# Altium schematic sheet USBC.SchDoc: DARKYDEN_USBC_A
size Letter; ApprovedBy: APPROUVÉ PAR; Author: Harold Malbrouck; Organization: Cegep Limoilou; Address1: 1300, 8e Avenue; Address2: Québec, QC; Address3: Canada; Address4: G1J 5L5; Revision: Rev.C; SheetNumber: 1; SheetTotal: 15
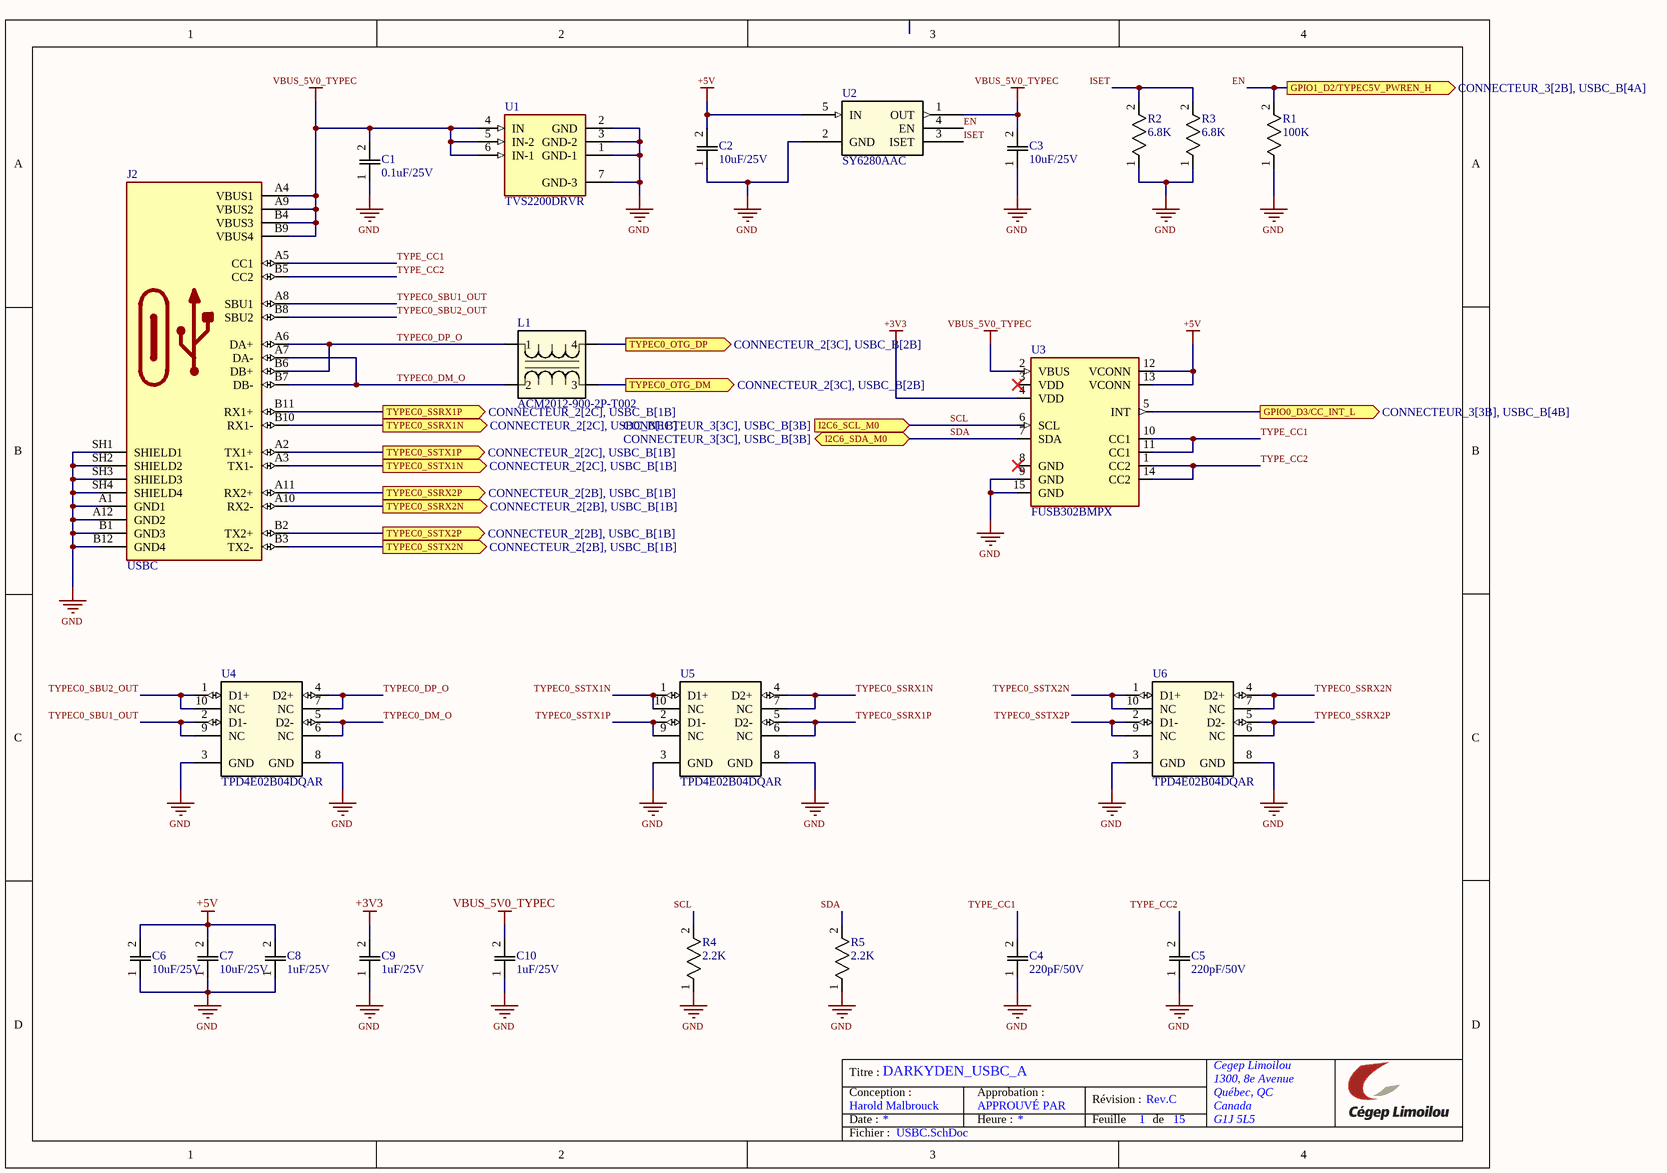
[diagram p0: USBC.SchDoc]

## Parts
C1  0.1uF/25V  [CAP_CC0805_YAG]
C2  10uF/25V  [CAP_CC0805_YAG]
C3  10uF/25V  [CAP_CC0805_YAG]
C4  220pF/50V  [CAP_CC0805_YAG]
C5  220pF/50V  [CAP_CC0805_YAG]
C6  10uF/25V  [CAP_CC0805_YAG]
C7  10uF/25V  [CAP_CC0805_YAG]
C8  1uF/25V  [CAP_CC0805_YAG]
C9  1uF/25V  [CAP_CC0805_YAG]
C10  1uF/25V  [CAP_CC0805_YAG]
J2  USBC  [MOLEX_2012670005]
L1  ACM2012-900-2P-T002  [ACM2012_TDK]
R1  100K  [RES_0816_SUS]
R2  6.8K  [RES_0816_SUS]
R3  6.8K  [RES_0816_SUS]
R4  2.2K  [RES_0816_SUS]
R5  2.2K  [RES_0816_SUS]
U1  TVS2200DRVR  [SON65P200X200X80-7N]
U2  SY6280AAC  [SOT23-5_SGY-M]
U3  FUSB302BMPX  [MLP-14]
U4  TPD4E02B04DQAR  [DQA0010A]
U5  TPD4E02B04DQAR  [DQA0010A]
U6  TPD4E02B04DQAR  [DQA0010A]

## Ports
GPIO0_D3/CC_INT_L (out, see CONNECTEUR_3[3B], USBC_B[4B]), GPIO1_D2/TYPEC5V_PWREN_H (out, see CONNECTEUR_3[2B], USBC_B[4A]), I2C6_SCL_M0 (in, see CONNECTEUR_3[3C], USBC_B[3B]), I2C6_SDA_M0 (bidir, see CONNECTEUR_3[3C], USBC_B[3B]), TYPEC0_OTG_DM (out, see CONNECTEUR_2[3C], USBC_B[2B]), TYPEC0_OTG_DP (out, see CONNECTEUR_2[3C], USBC_B[2B]), TYPEC0_SSRX1N (out, see CONNECTEUR_2[2C], USBC_B[1B]), TYPEC0_SSRX1P (out, see CONNECTEUR_2[2C], USBC_B[1B]), TYPEC0_SSRX2N (out, see CONNECTEUR_2[2B], USBC_B[1B]), TYPEC0_SSRX2P (out, see CONNECTEUR_2[2B], USBC_B[1B]), TYPEC0_SSTX1N (out, see CONNECTEUR_2[2C], USBC_B[1B]), TYPEC0_SSTX1P (out, see CONNECTEUR_2[2C], USBC_B[1B]), TYPEC0_SSTX2N (out, see CONNECTEUR_2[2B], USBC_B[1B]), TYPEC0_SSTX2P (out, see CONNECTEUR_2[2B], USBC_B[1B])

## Nets
+3V3: C9.2 U3.4(VDD)
+5V: C2.2 C6.2 C7.2 C8.2 U2.5(IN) U3.12(VCONN) U3.13(VCONN)
GND: C1.1 C2.1 C3.1 C4.1 C5.1 C6.1 C7.1 C8.1 C9.1 C10.1 J2.A1(GND1) J2.A12(GND2) J2.B1(GND3) J2.B12(GND4) J2.SH1(SHIELD1) J2.SH2(SHIELD2) J2.SH3(SHIELD3) J2.SH4(SHIELD4) R1.1 R2.1 R3.1 R4.1 R5.1 U1.1(GND-1) U1.2(GND) U1.3(GND-2) U1.7(GND-3) U2.2(GND) U3.9(GND) U3.15(GND) U4.3(GND) U4.8(GND) U5.3(GND) U5.8(GND) U6.3(GND) U6.8(GND)
VBUS_5V0_TYPEC: C1.2 C3.2 C10.2 J2.A4(VBUS1) J2.A9(VBUS2) J2.B4(VBUS3) J2.B9(VBUS4) U1.4(IN) U1.5(IN-2) U1.6(IN-1) U2.1(OUT) U3.2(VBUS)
EN: R1.2 U2.4(EN) ; port GPIO1_D2/TYPEC5V_PWREN_H
GPIO0_D3/CC_INT_L: U3.5(INT) ; port GPIO0_D3/CC_INT_L
ISET: R2.2 R3.2 U2.3(ISET)
SCL: R4.2 U3.6(SCL) ; port I2C6_SCL_M0
SDA: R5.2 U3.7(SDA) ; port I2C6_SDA_M0
TYPE_CC1: C4.2 J2.A5(CC1) U3.10(CC1) U3.11(CC1)
TYPE_CC2: C5.2 J2.B5(CC2) U3.1(CC2) U3.14(CC2)
TYPEC0_DM_O: J2.A7(DA-) J2.B7(DB-) L1.2 U4.5(D2-) U4.6(NC)
TYPEC0_DP_O: J2.A6(DA+) J2.B6(DB+) L1.1 U4.4(D2+) U4.7(NC)
TYPEC0_OTG_DM: L1.3 ; port TYPEC0_OTG_DM
TYPEC0_OTG_DP: L1.4 ; port TYPEC0_OTG_DP
TYPEC0_SBU1_OUT: J2.A8(SBU1) U4.2(D1-) U4.9(NC)
TYPEC0_SBU2_OUT: J2.B8(SBU2) U4.1(D1+) U4.10(NC)
TYPEC0_SSRX1N: J2.B10(RX1-) ; port TYPEC0_SSRX1N
TYPEC0_SSRX1N: U5.4(D2+) U5.7(NC)  [a separate net that carries the same name]
TYPEC0_SSRX1P: J2.B11(RX1+) ; port TYPEC0_SSRX1P
TYPEC0_SSRX1P: U5.5(D2-) U5.6(NC)  [a separate net that carries the same name]
TYPEC0_SSRX2N: J2.A10(RX2-) ; port TYPEC0_SSRX2N
TYPEC0_SSRX2N: U6.4(D2+) U6.7(NC)  [a separate net that carries the same name]
TYPEC0_SSRX2P: J2.A11(RX2+) ; port TYPEC0_SSRX2P
TYPEC0_SSRX2P: U6.5(D2-) U6.6(NC)  [a separate net that carries the same name]
TYPEC0_SSTX1N: J2.A3(TX1-) ; port TYPEC0_SSTX1N
TYPEC0_SSTX1N: U5.1(D1+) U5.10(NC)  [a separate net that carries the same name]
TYPEC0_SSTX1P: J2.A2(TX1+) ; port TYPEC0_SSTX1P
TYPEC0_SSTX1P: U5.2(D1-) U5.9(NC)  [a separate net that carries the same name]
TYPEC0_SSTX2N: J2.B3(TX2-) ; port TYPEC0_SSTX2N
TYPEC0_SSTX2N: U6.1(D1+) U6.10(NC)  [a separate net that carries the same name]
TYPEC0_SSTX2P: J2.B2(TX2+) ; port TYPEC0_SSTX2P
TYPEC0_SSTX2P: U6.2(D1-) U6.9(NC)  [a separate net that carries the same name]

Not connected (* = marked no-connect by the designer): U3 3(VDD)* 8(GND)*

## Notes on the sheet
- Titre :
- Conception :
- Date :
- Approbation :
- Heure :
- Révision :
- Feuille
- de
- Fichier :

## Library data of the parts
C1-C10 = Capacitor_0805: No Description Available; Mfr_Name: Yageo
J2 = USBC: USB-C (USB TYPE-C) USB 3.2 Gen 2 (USB 3.1 Gen 2, Superspeed + (USB 3.1)) Receptacle Connector 24 Position Surface Mount, Right Angle; Through Hole; MF: Molex; MP: 2012670005; SnapEDA_Link: https://www.snapeda.com/parts/2012670005/Molex/view-part/?ref=snap; Package: None; Value: *; Check_prices: https://www.snapeda.com/parts/2012670005/Molex/view-part/?ref=eda
L1 = ACM2012-900-2P-T002: No Description Available; Mfr_Name: TDK
R1-R5 = RG1608P-104-B-T5: No Description Available; Mfr_Name: Susumu
U1 = TVS2200DRVR: 22V flat-clamp surge protection device; MF: Texas Instruments; SnapEDA_Link: https://www.snapeda.com/parts/TVS2200DRVR/Texas+Instruments/view-part/?ref=snap; Package: WSON-6 Texas Instruments; Value: *; MP: TVS2200DRVR; Check_prices: https://www.snapeda.com/parts/TVS2200DRVR/Texas+Instruments/view-part/?ref=eda
U2 = SY6280AAC: No Description Available; Mfr_Name: Silergy; RefDes: RefDes; Type: Type
U3 = FUSB302BMPX: USB Controller USB 3.1 USB Interface 14-MLP (2.5x2.5); MF: ON Semiconductor; SnapEDA_Link: https://www.snapeda.com/parts/FUSB302BMPX/Onsemi/view-part/?ref=snap; Package: WQFN-14 ON Semiconductor; Value: *; MP: FUSB302BMPX; Check_prices: https://www.snapeda.com/parts/FUSB302BMPX/Onsemi/view-part/?ref=eda
U4-U6 = TPD4E02B04DQAR: No Description Available; Mfr_Name: Texas Instruments; CompType: IC; TYPE: TYPE; RefDes: RefDes; Application_BuildNumber: *; PartNumber: TPD4E02B04DQAR; PackageReference: DQA0010A; MountType: SMT; RoHS: Y; Manufacturer: Texas Instruments